# Altium schematic sheet KursSCH2.schdoc
size 420 x 297 mm; DocumentNumber: СПбПУ 12.03.2019 + Э3; SheetNumber: 2; SheetTotal: 3; Format: A3
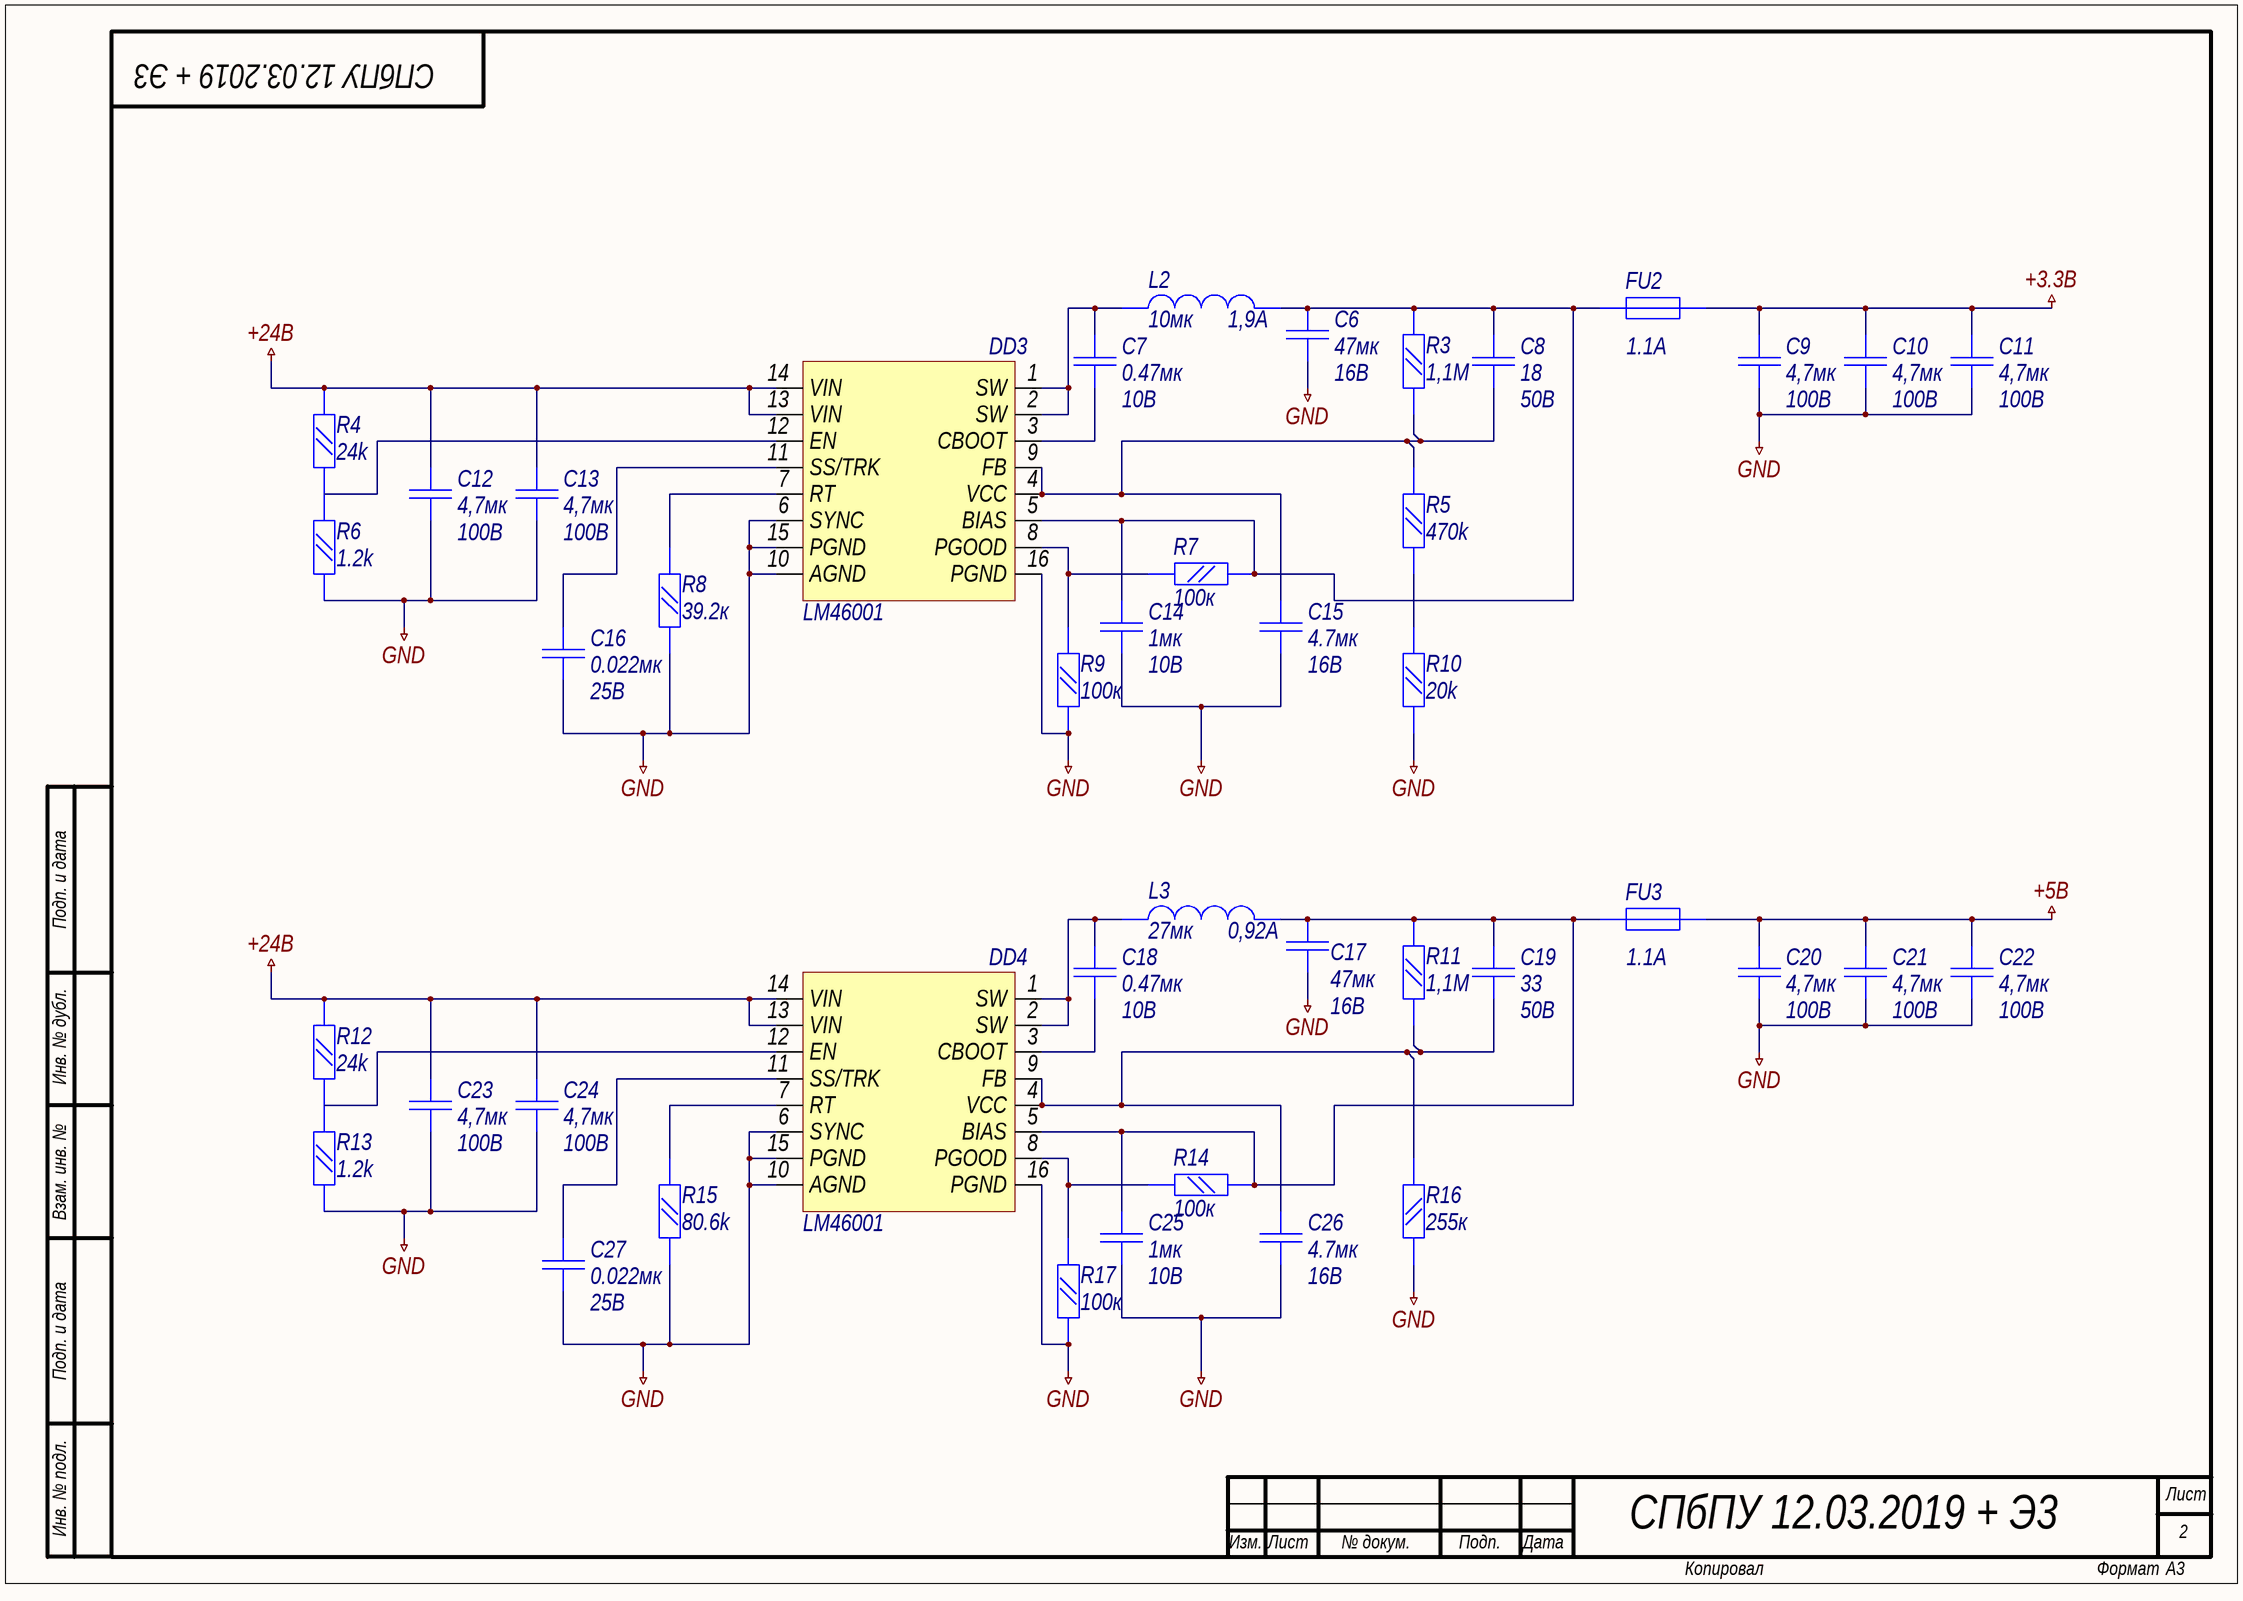
[diagram p0: KursSCH2.schdoc]

## Parts
C6  value 47мк  Voltage: 16В  [C1210]  (hidden comment: Capacitor)
C7  value 0.47мк  Voltage: 10В  [C0603]  (hidden comment: Capacitor)
C8  value 18  Voltage: 50В  [C0402]  (hidden comment: Capacitor)
C9  value 4,7мк  Voltage: 100В  [C1206]  (hidden comment: Capacitor)
C10  value 4,7мк  Voltage: 100В  [C1206]  (hidden comment: Capacitor)
C11  value 4,7мк  Voltage: 100В  [C1206]  (hidden comment: Capacitor)
C12  value 4,7мк  Voltage: 100В  [C1206]  (hidden comment: Capacitor)
C13  value 4,7мк  Voltage: 100В  [C1206]  (hidden comment: Capacitor)
C14  value 1мк  Voltage: 10В  [C0603]  (hidden comment: Capacitor)
C15  value 4.7мк  Voltage: 16В  [C0603]  (hidden comment: Capacitor)
C16  value 0.022мк  Voltage: 25В  [C0603]  (hidden comment: Capacitor)
C17  value 47мк  Voltage: 16В  [C1210]  (hidden comment: Capacitor)
C18  value 0.47мк  Voltage: 10В  [C0603]  (hidden comment: Capacitor)
C19  value 33  Voltage: 50В  [C0402]  (hidden comment: Capacitor)
C20  value 4,7мк  Voltage: 100В  [C1206]  (hidden comment: Capacitor)
C21  value 4,7мк  Voltage: 100В  [C1206]  (hidden comment: Capacitor)
C22  value 4,7мк  Voltage: 100В  [C1206]  (hidden comment: Capacitor)
C23  value 4,7мк  Voltage: 100В  [C1206]  (hidden comment: Capacitor)
C24  value 4,7мк  Voltage: 100В  [C1206]  (hidden comment: Capacitor)
C25  value 1мк  Voltage: 10В  [C0603]  (hidden comment: Capacitor)
C26  value 4.7мк  Voltage: 16В  [C0603]  (hidden comment: Capacitor)
C27  value 0.022мк  Voltage: 25В  [C0603]  (hidden comment: Capacitor)
DD3  LM46001  [LM46001]
DD4  LM46001  [LM46001]
FU2  Rated Current: 1.1A  [F1812]  (hidden comment: Fuse)
FU3  Rated Current: 1.1A  [F1812]  (hidden comment: Fuse)
L2  I: 1,9А  L: 10мк  [747779115]  (hidden comment: 7447779115)
L3  I: 0,92А  L: 27мк  [747779115]  (hidden comment: 7447779115)
R3  value 1,1М  [R0805]  (hidden comment: Resistor_0,125W)
R4  value 24k  [R0603]  (hidden comment: Resistor_0,125W)
R5  value 470k  [R0603]  (hidden comment: Resistor_0,125W)
R6  value 1.2k  [R0603]  (hidden comment: Resistor_0,125W)
R7  value 100к  [R0805]  (hidden comment: Resistor_0,125W)
R8  value 39.2к  [R0603]  (hidden comment: Resistor_0,125W)
R9  value 100к  [R0805]  (hidden comment: Resistor_0,125W)
R10  value 20k  [R0603]  (hidden comment: Resistor_0,125W)
R11  value 1,1М  [R0805]  (hidden comment: Resistor_0,125W)
R12  value 24k  [R0603]  (hidden comment: Resistor_0,125W)
R13  value 1.2k  [R0603]  (hidden comment: Resistor_0,125W)
R14  value 100к  [R0805]  (hidden comment: Resistor_0,125W)
R15  value 80.6k  [R0603]  (hidden comment: Resistor_0,125W)
R16  value 255к  [R0603]  (hidden comment: Resistor_0,125W)
R17  value 100к  [R0805]  (hidden comment: Resistor_0,125W)

## Nets
+3.3В: C9.2 C10.2 C11.2 FU2.2
+5В: C20.2 C21.2 C22.2 FU3.2
+24В: C12.2 C13.2 C23.2 C24.2 DD3.13(VIN) DD3.14(VIN) DD4.13(VIN) DD4.14(VIN) R4.2 R12.2
GND: C6.1 C9.1 C10.1 C11.1 C12.1 C13.1 C14.1 C15.1 C16.2 C17.1 C20.1 C21.1 C22.1 C23.1 C24.1 C25.1 C26.1 C27.2 DD3.6(SYNC) DD3.10(AGND) DD3.15(PGND) DD3.16(PGND) DD4.6(SYNC) DD4.10(AGND) DD4.15(PGND) DD4.16(PGND) R6.1 R8.1 R9.1 R10.1 R13.1 R15.1 R16.1 R17.1
NetC6_2: C6.2 C8.2 C14.2 DD3.5(BIAS) FU2.1 L2.2 R3.2 R7.1
NetC7_1: C7.1 DD3.3(CBOOT)
NetC7_2: C7.2 DD3.1(SW) DD3.2(SW) L2.1
NetC8_1: C8.1 C15.2 DD3.4(VCC) DD3.9(FB) R3.1 R5.2
NetC16_1: C16.1 DD3.11(SS/TRK)
NetC17_2: C17.2 C19.2 C25.2 DD4.5(BIAS) FU3.1 L3.2 R11.2 R14.2
NetC18_1: C18.1 DD4.3(CBOOT)
NetC18_2: C18.2 DD4.1(SW) DD4.2(SW) L3.1
NetC19_1: C19.1 C26.2 DD4.4(VCC) DD4.9(FB) R11.1 R16.2
NetC27_1: C27.1 DD4.11(SS/TRK)
NetDD3_7: DD3.7(RT) R8.2
NetDD3_8: DD3.8(PGOOD) R7.2 R9.2
NetDD3_12: DD3.12(EN) R4.1 R6.2
NetDD4_7: DD4.7(RT) R15.2
NetDD4_8: DD4.8(PGOOD) R14.1 R17.2
NetDD4_12: DD4.12(EN) R12.1 R13.2
NetR5_1: R5.1 R10.2

## Notes on the sheet
- Подп. и дата
- Инв. № дубл.
- Взам. инв. №
- Инв. № подл.
- Лист
- Изм.
- № докум.
- Подп.
- Дата
- Копировал
- Формат

## Library data of the parts
C6 C17 = GRM32ER61C476KE15L: Manufacturer: Murata; Type: Конденсатор; ID: 145; Tolerance: ±10%; Dielectric Type: X5R; Application Category: 1; Working Temperature Min: -55°С; Working Temperature Max: +85°С; Part Number: GRM32ER61C476KE15L; Footprint: 1210
C7 C18 = GRM188R71A474KA61D: Manufacturer: Murata; Type: Конденсатор; ID: 133; Tolerance: ±10%; Dielectric Type: X7R; Application Category: 1; Working Temperature Min: -55°С; Working Temperature Max: +125°С; Part Number: GRM188R71A474KA61D; Footprint: 0603
C8 = GRM1555C1H180JA01D: Manufacturer: Murata; Type: Конденсатор; ID: 191; Tolerance: ±5%; Dielectric Type: NP0; Application Category: 1; Working Temperature Min: -55°С; Working Temperature Max: +125°С; Part Number: GRM1555C1H180JA01D; Footprint: 0402
C9-C13 C20-C24 = GRM31CR61H106KA12L: Part Number: GRM31CC72A475ME11; Manufacturer: Murata; Type: Конденсатор; ID: 143; Tolerance: ±10%; Dielectric Type: X7S; Application Category: 1; Working Temperature Min: -55°С; Working Temperature Max: +125°С; Footprint: 1206
C14 C25 = GRM188R61A105KA01D: Manufacturer: Murata; Type: Конденсатор; ID: 134; Tolerance: ±10%; Dielectric Type: X5R; Application Category: 1; Working Temperature Min: -55°С; Working Temperature Max: +85°С; Part Number: GRM188R61A105KA01D; Footprint: 0603
C15 C26 = GRM188R61A475KE15D: Manufacturer: Murata; Type: Конденсатор; ID: 175; Tolerance: ±10%; Dielectric Type: X5R; Application Category: 1; Part Number: GRM188R61A475KE15D; Footprint: 0603
C16 C27 = GRM188R71E223JA01D: Manufacturer: Murata; Type: Конденсатор; ID: 154; Tolerance: ±5%; Dielectric Type: X7R; Application Category: 1; Working Temperature Min: -55°С; Working Temperature Max: +125°С; Part Number: GRM188R71E223JA01D; Footprint: 0603
C19 = GRM1555C1H330JA01D: Manufacturer: Murata; Type: Конденсатор; ID: 188; Tolerance: ±5%; Dielectric Type: NP0; Application Category: 1; Working Temperature Min: -55°С; Working Temperature Max: +125°С; Part Number: GRM1555C1H330JA01D; Footprint: 0402
FU2 FU3 = LP-MSM110-2: ID: 2; Limit Voltage: 6В; Resistance: 0.26ohm; Published: 24.09.2010; Publisher: Andrew Danich; Value: LP-MSM110-2; Type: Вставка плавкая
R3 R11 = RC0805JR-071M1L: Manufacturer: Yageo; ID: 91; Limit Voltage: 150V; Tolerance: ±5%; Temperature Coefficient: 100ppm; Total Power Dissipation: 0.125W; Series Type: Thick-Film; Application Category: 1; Working Temperature Min: -55°С; Working Temperature Max: +155°С; Type: Резистор; Part Number: RC0805JR-071M1L; Footprint: 0805
R4 R12 = RC0603JR-0724KL: Manufacturer: Yageo; ID: 35; Limit Voltage: 50V; Tolerance: ±5%; Temperature Coefficient: 100ppm; Total Power Dissipation: 0.1W; Series Type: Thick-Film; Application Category: 1; Working Temperature Min: -55°С; Working Temperature Max: +155°С; Type: Резистор; Part Number: RC0603JR-0724KL; Footprint: 0603
R5 = RC0603JR-07470KL: Manufacturer: Yageo; ID: 62; Limit Voltage: 50V; Tolerance: ±5%; Temperature Coefficient: 100ppm; Total Power Dissipation: 0.1W; Series Type: Thick-Film; Application Category: 1; Working Temperature Min: -55°С; Working Temperature Max: +155°С; Type: Резистор; Part Number: RC0603JR-07470KL; Footprint: 0603
R6 R13 = RC0603JR-071K2L: Manufacturer: Yageo; ID: 7; Limit Voltage: 50V; Tolerance: ±5%; Temperature Coefficient: 100ppm; Total Power Dissipation: 0.1W; Series Type: Thick-Film; Application Category: 1; Working Temperature Min: -55°С; Working Temperature Max: +155°С; Type: Резистор; Part Number: RC0603JR-071K2L; Footprint: 0603
R7 R9 R14 R17 = RC0805JR-07100KL: Manufacturer: Yageo; ID: 98; Limit Voltage: 150V; Tolerance: ±5%; Temperature Coefficient: 100ppm; Total Power Dissipation: 0.125W; Series Type: Thick-Film; Application Category: 1; Working Temperature Min: -55°С; Working Temperature Max: +155°С; Type: Резистор; Part Number: RC0805JR-07100KL; Footprint: 0805
R8 = RC0603FR-0739K2L: Manufacturer: Yageo; ID: 436; Limit Voltage: 50V; Tolerance: ±1%; Temperature Coefficient: 100ppm; Total Power Dissipation: 0.125W; Series Type: Thick-Film; Application Category: 1; Working Temperature Min: -55°С; Working Temperature Max: +155°С; Type: Резистор; Part Number: RC0603FR-0739K2L; Footprint: 0603
R10 = RC0603FR-0720KL: Manufacturer: Yageo; ID: 259; Limit Voltage: 50V; Tolerance: ±1%; Temperature Coefficient: 100ppm; Total Power Dissipation: 0.1W; Series Type: Thick-Film; Application Category: 1; Working Temperature Min: -55°С; Working Temperature Max: +155°С; Type: Резистор; Part Number: RC0603FR-0720KL; Footprint: 0603
R15 = RC0603FR-0780K6L: Manufacturer: Yageo; ID: 325; Limit Voltage: 50V; Tolerance: ±1%; Temperature Coefficient: 100ppm; Total Power Dissipation: 0.1W; Series Type: Thick-Film; Application Category: 1; Working Temperature Min: -55°С; Working Temperature Max: +155°С; Type: Резистор; Part Number: RC0603FR-0780K6L; Footprint: 0603
R16 = RC0603FR-07255KL: Manufacturer: Yageo; ID: 322; Limit Voltage: 50V; Tolerance: ±1%; Temperature Coefficient: 100ppm; Total Power Dissipation: 0.1W; Series Type: Thick-Film; Application Category: 1; Working Temperature Min: -55°С; Working Temperature Max: +155°С; Type: Резистор; Part Number: RC0603FR-07255KL; Footprint: 0603
L2 L3 = 7447779115: Name: 7447779115